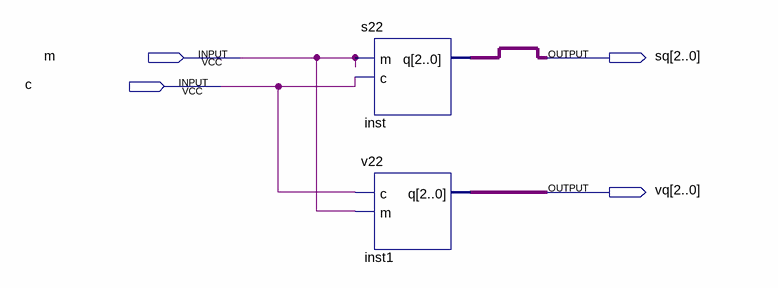
[diagram p0: schematic sheet]
// Quartus schematic wsv22.bdf as structural Verilog: 2 symbols, 4 pins
module wsv22 (
  input  m,
  input  c,
  output [2:0] sq,
  output [2:0] vq
);

  s22 inst (.m(m), .c(c), .q(sq));
  v22 inst1 (.c(c), .m(m), .q(vq));
endmodule
